# Altium project bus card.PrjPcb
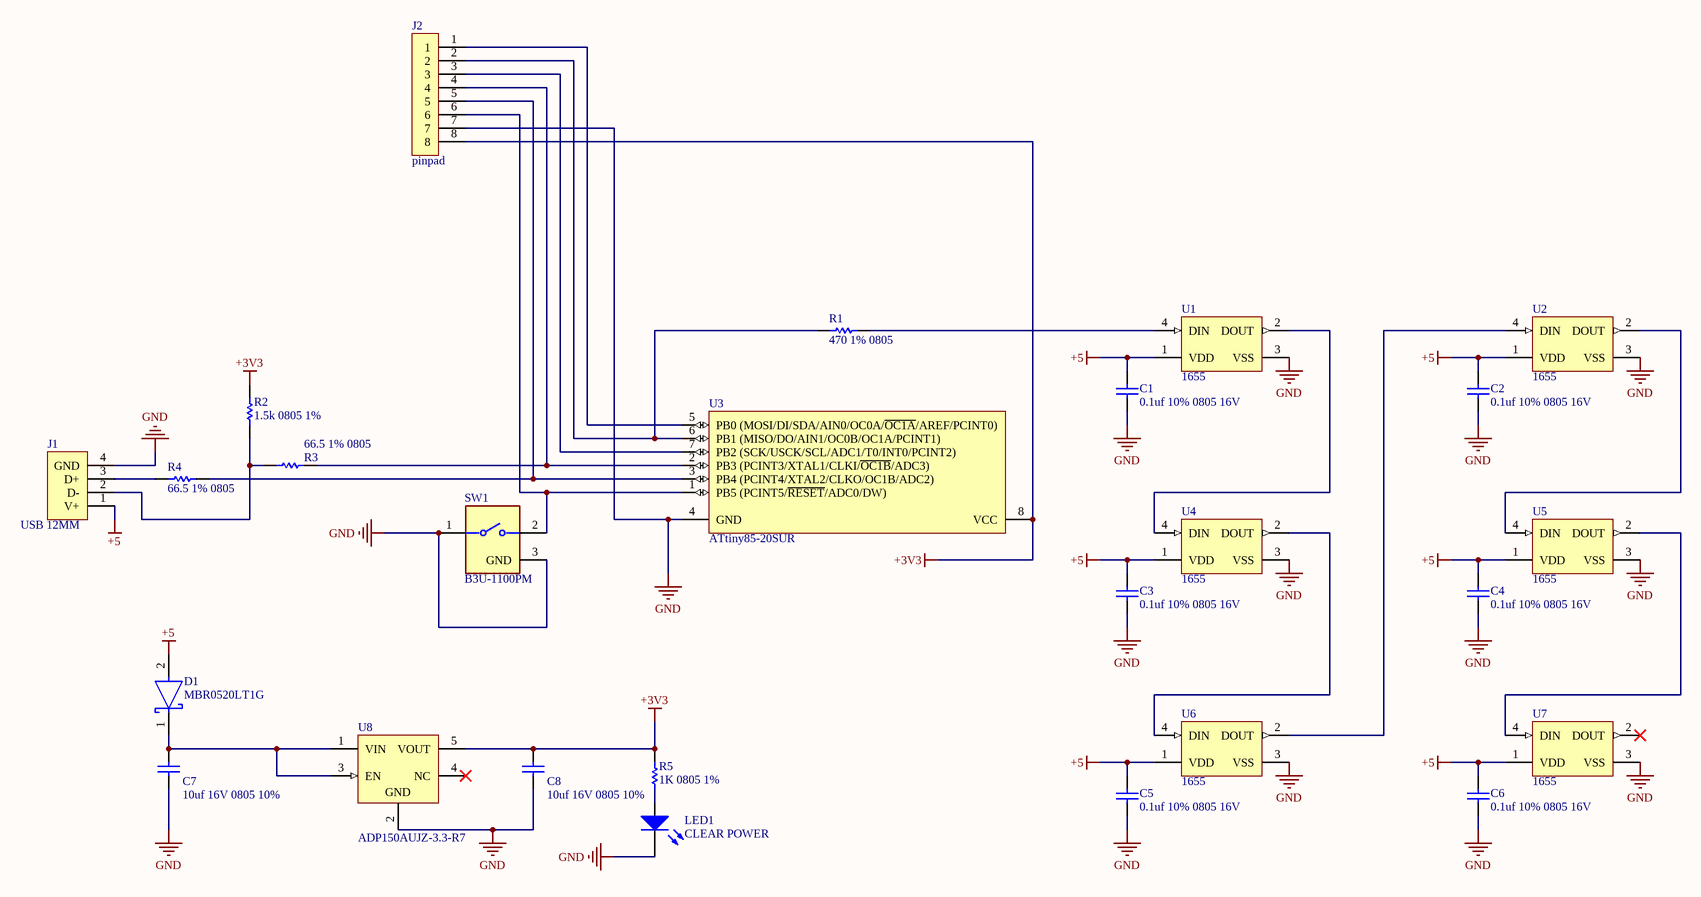
[diagram p0: Sheet1.SchDoc]
1 sheet, 26 parts. Net scope: global (net labels, ports and power ports of the same name join across sheets).
Board file: PCB1.PcbDoc

## Sheet Sheet1.SchDoc
size B; SheetNumber: 1; SheetTotal: 1

### Parts
C1  0.1uf 10% 0805 16V  [CAPC2013X140X50NL20T25]
C2  0.1uf 10% 0805 16V  [CAPC2013X140X50NL20T25]
C3  0.1uf 10% 0805 16V  [CAPC2013X140X50NL20T25]
C4  0.1uf 10% 0805 16V  [CAPC2013X140X50NL20T25]
C5  0.1uf 10% 0805 16V  [CAPC2013X140X50NL20T25]
C6  0.1uf 10% 0805 16V  [CAPC2013X140X50NL20T25]
C7  10uf 16V 0805 10%  [CAPC2013X145X50LL20T25]
C8  10uf 16V 0805 10%  [CAPC2013X145X50LL20T25]
D1  MBR0520LT1G  [FP-425-04-IPC_C]
J1  USB 12MM  [USB A]
J2  pinpad  [open_pad_8]
LED1  CLEAR POWER  [0805_A]
R1  470 1% 0805  [RESC2013X50X30LL20T20]
R2  1.5k 0805 1%  [RESC2013X60X35LL10T20]
R3  66.5 1% 0805  [RESC2013X50X30NL20T20]
R4  66.5 1% 0805  [RESC2013X50X30NL20T20]
R5  1K 0805 1%  [RESC2013X60X35ML10T20]
SW1  B3U-1100PM  [FP-B3U-1100PM-MFG]
U1  1655  [ADA-RGB-1655_V]
U2  1655  [ADA-RGB-1655_V]
U3  ATtiny85-20SUR  [8S2_L]
U4  1655  [ADA-RGB-1655_V]
U5  1655  [ADA-RGB-1655_V]
U6  1655  [ADA-RGB-1655_V]
U7  1655  [ADA-RGB-1655_V]
U8  ADP150AUJZ-3.3-R7  [ADI-UJ-5_M]

### Nets
+3V3: C8.2 J2.8 R2.2 R5.1 U3.8(VCC) U8.5(VOUT)
+5: C1.2 C2.2 C3.2 C4.2 C5.2 C6.2 D1.2(A) J1.1(V+) U1.1(VDD) U2.1(VDD) U4.1(VDD) U5.1(VDD) U6.1(VDD) U7.1(VDD)
GND: C1.1 C2.1 C3.1 C4.1 C5.1 C6.1 C7.1 C8.1 J1.4(GND) J2.7 LED1.1(K) SW1.1 SW1.3(GND) U1.3(VSS) U2.3(VSS) U3.4(GND) U4.3(VSS) U5.3(VSS) U6.3(VSS) U7.3(VSS) U8.2(GND)
NetC7_2: C7.2 D1.1(C) U8.1(VIN) U8.3(EN)
NetJ1_2: J1.2(D-) R2.1 R3.1
NetJ1_3: J1.3(D+) R4.1
NetJ2_1: J2.1 U3.5(PB0_(MOSI/DI/SDA/AIN0/OC0A/~{OC1A}/AREF/PCINT0))
NetJ2_2: J2.2 R1.1 U3.6(PB1_(MISO/DO/AIN1/OC0B/OC1A/PCINT1))
NetJ2_3: J2.3 U3.7(PB2_(SCK/USCK/SCL/ADC1/T0/INT0/PCINT2))
NetJ2_4: J2.4 R3.2 U3.2(PB3_(PCINT3/XTAL1/CLKI/~{OC1B}/ADC3))
NetJ2_5: J2.5 R4.2 U3.3(PB4_(PCINT4/XTAL2/CLKO/OC1B/ADC2))
NetJ2_6: J2.6 SW1.2 U3.1(PB5_(PCINT5/~{RESET}/ADC0/DW))
NetLED1_2: LED1.2(A) R5.2
NetR1_2: R1.2 U1.4(DIN)
NetU1_2: U1.2(DOUT) U4.4(DIN)
NetU2_2: U2.2(DOUT) U5.4(DIN)
NetU2_4: U2.4(DIN) U6.2(DOUT)
NetU4_2: U4.2(DOUT) U6.4(DIN)
NetU5_2: U5.2(DOUT) U7.4(DIN)

Not connected (* = marked no-connect by the designer): U7 2(DOUT)*; U8 4(NC)*

### Library data of the parts
C1-C6 = CMP-2007-04629-1: Part Number: 08055C104K4Z2A; Manufacturer: AVX Interconnect / Elco
C7 C8 = CMP-1036-04746-2: Manufacturer: Kemet; Part Number: C0805C105K4PACTU
D1 = CMP-1055-00425-2: DIODE SCHOTTKY 20V 500MA SOD123; Polarity: Standard; Peak Non-Repetitive Surge Current: 5.5A; Forward Voltage: 385mV; Element Configuration: Single; Peak Reverse Current: 250uA; Max Repetitive Reverse Voltage (Vrrm): 20V; Voltage Rating (DC): 20V; Case/Package: SOD-123-2; Number of Pins: 2; Output Current: 500mA; Min Operating Temperature: -65°C; Lead Free: Lead Free; REACH SVHC: No SVHC; Max Reverse Voltage (DC): 20V; Termination: SMD/SMT; Average Rectified Current: 500mA; Max Surge Current: 5.5A; Package Quantity: 3000; Height: 1.12mm; Current Rating: 500mA; Forward Current: 500mA; Max Forward Surge Current (Ifsm): 5.5A; Packaging: Tape and Reel; Length: 2.69mm; Radiation Hardening: No; Max Reverse Leakage Current: 250uA; Width: 1.6mm; Contact Plating: Tin; Max Operating Temperature: 125°C
J1 = USB
LED1 = CMP-1426-00009-1: SMD mono-color Chip LED, WL-SMCW, Bright Green; PartNumber: 150080VS75000; Manufacturer: Wuerth Elektronik; ComponentLink1Description: Manufacturer URL; Color: Bright Green; PackageReference: 0805_A; ComponentLink1URL: http://www.we-online.com; ComponentLink2Description: Datasheet; ComponentLink2URL: http://katalog.we-online.com/led/datasheet/150080VS75000.pdf
R1 = CMP-2001-03932-1: Manufacturer: Vishay Dale; Part Number: CRCW0805470RFKEA
R2 = CMP-1659-00010-2: RES 1.50K OHM 1/8W 1% 0805 SMD; Manufacturer: Yageo; PartNumber: RC0805FR-071K5L; PackageReference: 0805; ComponentLink1URL: http://www.yageo.com/documents/recent/PYu-RC_Group_51_RoHS_L_04.pdf; ComponentLink1Description: Datasheet
R3 R4 = CMP-2001-04066-1: Manufacturer: Vishay Dale; Part Number: CRCW0805680RFKEA
R5 = CMP-2100-03671-1: Chip Resistor, 1 KOhm, +/- 1%, 125 mW, -55 to 155 degC, 0805 (2012 Metric), RoHS, Tape and Reel; Manufacturer: Yageo; Temperature Coefficient: 100ppm/degreesC; Voltage Rating (DC): 150V; Max Power Dissipation: 125mW; Resistance: 1KOhm; Number of Pins: 2; Number of Terminations: 2; Datasheet URL: http://www.yageo.com/NewPortal/yageodocoutput?fileName=/pdf/R-Chip/PYu-RC_Group_51_RoHS_L_5.pdf; Length: 0.079inch; Package Description: 2-Pin Surface Mounted Device, Body 2 x 1.25 mm; Depth: 1.25mm; Height: 0.024inch; Military Standard: Not; Case/Package: 0805; Package Reference: 0805; RoHSCompliant: true; Lead Free: LeadFree; Packaging: TapeandReel; Package Quantity: 1; Datasheet Version: Rev. 5, 10/2016; Tolerance: 1%; Min Operating Temperature: -55degC; Voltage Rating: 150V; Composition: ThickFilm; Case Code (Imperial): 0805; Power Rating: 125mW; Width: 0.049inch; Case Code (Metric): 2012; Manufacturer URL: http://www.yageo.com/; Max Operating Temperature: 155degC; REACH SVHC: Unknown; Termination: SMD/SMT
SW1 = CMP-08834-000028-1: SWITCH TACTILE SPST-NO 0.05A 12V; Switch Travel: 0.15mm; Throw Configuration: SPST; Current Rating: 50mA; Illumination Type: Non-Illuminated; Actuator Length: 0.4mm; Operating Force: 1.5N; Connector Type: SMD/SMT; Contact Resistance: 100mR; Actuator Type: Standard; Electrical Life: 200000Cycles; Switch Function: Off-Mom; Ratings: Dust Proof; Max Operating Temperature: 70°C; Weight: 0.022g; Series: B3U; Min Operating Temperature: -25°C; Voltage Rating (DC): 12V; Orientation: Straight; Package Quantity: 1000; Packaging: Tape and Reel; RoHS Compliant: Yes; REACH SVHC: No SVHC; Max Voltage Rating (DC): 12V; Mount: Surface Mount; Case/Package: SMD/SMT; Mechanical Life: 200000Cycles; Termination: SMD/SMT
U1 U2 U4-U7 = CMP-2000-05026-1: Intelligent Control LED Integrated Light Source, 3.5 to 5.3 V, -25 to 80 degC, 4-Pin SMD, RoHS, Tape and Reel; Manufacturer: Adafruit-Industries-LLC; Number of LEDs: 10; Configuration: Discrete; Utilized LED: WS2812(5050); Datasheet URL: http://datasheet.octopart.com/ADA1655-Adafruit-Industries-datasheet-32028139.pdf; Series: Neopixel; Interface: -; Package Description: 4-Pin Surface Mount Device, Body 5 x 5 mm; Color: Red,Green,Blue(RGB); Category: Optoelectronics; Controller Type: -; Package Reference: 1655; Manufacturer URL: https://www.adafruit.com/; Mounting Type: SurfaceMount; Datasheet Version: May-13; Size / Dimension: 5.00mmLx5.00mmW; Family: Addressable,Specialty
U3 = CMP-0093-00351-1: 8-bit AVR Microcontroller, 20MHz, 2.7-5.5V, 8K Flash, 512 Bytes EEPROM, 512 Bytes SRAM, Industrial Grade (-40°C to 85°C), 8-Lead SOIC, Pb-Free, Reel; ComponentLink3URL: http://www.atmel.com/dyn/resources/prod_documents/2586S.pdf; ComponentLink2URL: http://www.atmel.com/dyn/resources/prod_documents/doc2586.pdf; PackageReference: 8S2; ComponentLink1Description: Manufacturer URL; ComponentLink2Description: ATtiny25/45/85 Datasheet; ComponentLink1URL: http://www.atmel.com/; DatasheetVersion: revN, Apr-2011; PackageDescription: 8-Lead, 0.208" Body, Plastic Small Outline Package (EIAJ); ComponentLink3Description: ATtiny25/45/85 Summary; PackageVersion: revF, Apr-2008
U8 = CMP-0786-00394-1: Ultralow Noise, 150 mA CMOS Linear Regulator, 2.2 to 5.5 V Vin, 3.3 V Vout, Industrial, 5-pin SOT23 (UJ-5), Reel; Manufacturer: Analog Devices; Supply Current IGND @ Small Load: 10uA; Vin (min) (V): 2.2; Iout max: 150mA; Preset Vout Values (V): 3.3; Vin (max) (V): 5.5; ComponentLink2Description: Datasheet; PackageReference: UJ-5; DatasheetVersion: Rev. A; PackageDescription: 5-Pin Thin Small Outline Transistor Package, Body 2.9 x 1.6 mm, Pitch 0.95 mm; ComponentLink4URL: Product URL:http://www.analog.com/en/ADP150/productSearch.html; Packing: Reel; ComponentLink1URL: http://www.analog.com/en/index.html; PartNumber: ADP150AUJZ-3.3-R7; PackageVersion: 100708-A, 10/2008; ComponentLink3Description: Package Specification; ComponentLink3URL: http:/www.analog.com/static/imported-files/packages/PKG_PDF/TSOT(UJ)/UJ_5.pdf; ComponentLink4Description: URL Link1; ComponentLink2URL: http://www.analog.com/static/imported-files/data_sheets/ADP150.pdf; Code_JEDEC: MO-193-AB; Mounting Technology: Surface Mount; ComponentLink1Description: Manufacturer URL